# EAGLE schematic calculator6 (EAGLE 9.6.2)

## Sheet 1 of 2
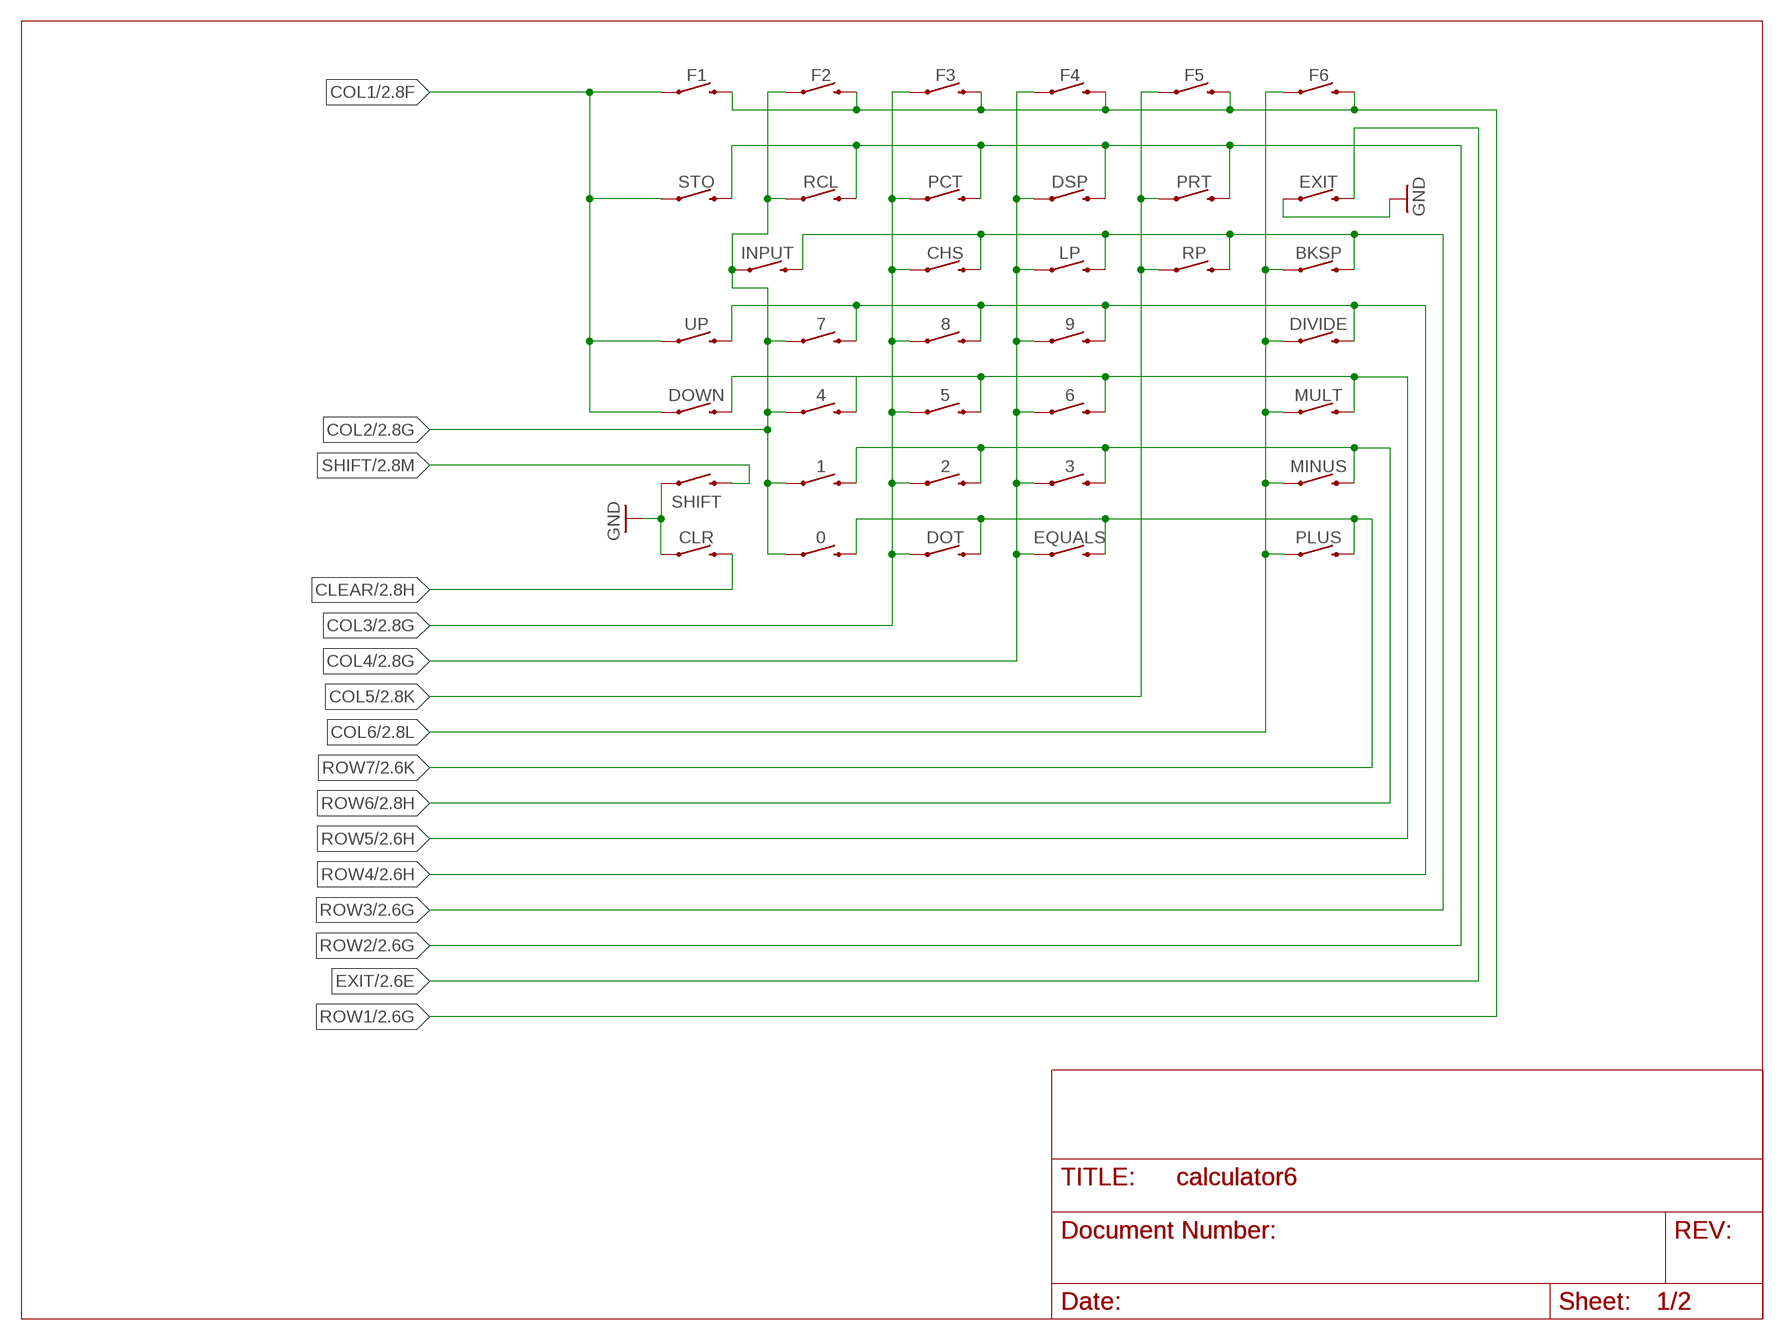
[diagram p0: schematic, sheet 1]

### Parts
0  BUTTON  [BUTTON]
1  BUTTON  [BUTTON]
2  BUTTON  [BUTTON]
3  BUTTON  [BUTTON]
4  BUTTON  [BUTTON]
5  BUTTON  [BUTTON]
6  BUTTON  [BUTTON]
7  BUTTON  [BUTTON]
8  BUTTON  [BUTTON]
9  BUTTON  [BUTTON]
BKSP  BUTTON  [BUTTON]
CHS  BUTTON  [BUTTON]
CLR  BUTTON  [BUTTON]
DIVIDE  BUTTON  [BUTTON]
DOT  BUTTON  [BUTTON]
DOWN  BUTTON  [BUTTON]
DSP  BUTTON  [BUTTON]
EQUALS  BUTTON  [BUTTON]
EXIT  BUTTON  [BUTTON]
F1  BUTTON  [BUTTON]
F2  BUTTON  [BUTTON]
F3  BUTTON  [BUTTON]
F4  BUTTON  [BUTTON]
F5  BUTTON  [BUTTON]
F6  BUTTON  [BUTTON]
INPUT  BUTTON  [BUTTON]
LP  BUTTON  [BUTTON]
MINUS  BUTTON  [BUTTON]
MULT  BUTTON  [BUTTON]
PCT  BUTTON  [BUTTON]
PLUS  BUTTON  [BUTTON]
PRT  BUTTON  [BUTTON]
RCL  BUTTON  [BUTTON]
RP  BUTTON  [BUTTON]
SHIFT  BUTTON  [BUTTON]
STO  BUTTON  [BUTTON]
UP  BUTTON  [BUTTON]

### Nets
CLEAR: CLR.3 ; also sheet 2
COL1: DOWN.1 F1.1 STO.1 UP.1 ; also sheet 2
COL2: 0.1 1.1 4.1 7.1 F2.1 INPUT.1 RCL.1 ; also sheet 2
COL3: 2.1 5.1 8.1 CHS.1 DOT.1 F3.1 PCT.1 ; also sheet 2
COL4: 3.1 6.1 9.1 DSP.1 EQUALS.1 F4.1 LP.1 ; also sheet 2
COL5: F5.1 PRT.1 RP.1 ; also sheet 2
COL6: BKSP.1 DIVIDE.1 F6.1 MINUS.1 MULT.1 PLUS.1 ; also sheet 2
EXIT: EXIT.3 ; also sheet 2
GND: CLR.1 EXIT.1 SHIFT.1 ; also sheet 2
ROW1: F1.3 F2.3 F3.3 F4.3 F5.3 F6.3 ; also sheet 2
ROW2: DSP.3 PCT.3 PRT.3 RCL.3 STO.3 ; also sheet 2
ROW3: BKSP.3 CHS.3 INPUT.3 LP.3 RP.3 ; also sheet 2
ROW4: 7.3 8.3 9.3 DIVIDE.3 UP.3 ; also sheet 2
ROW5: 4.3 5.3 6.3 DOWN.3 MULT.3 ; also sheet 2
ROW6: 1.3 2.3 3.3 MINUS.3 ; also sheet 2
ROW7: 0.3 DOT.3 EQUALS.3 PLUS.3 ; also sheet 2
SHIFT: SHIFT.3 ; also sheet 2

## Sheet 2 of 2
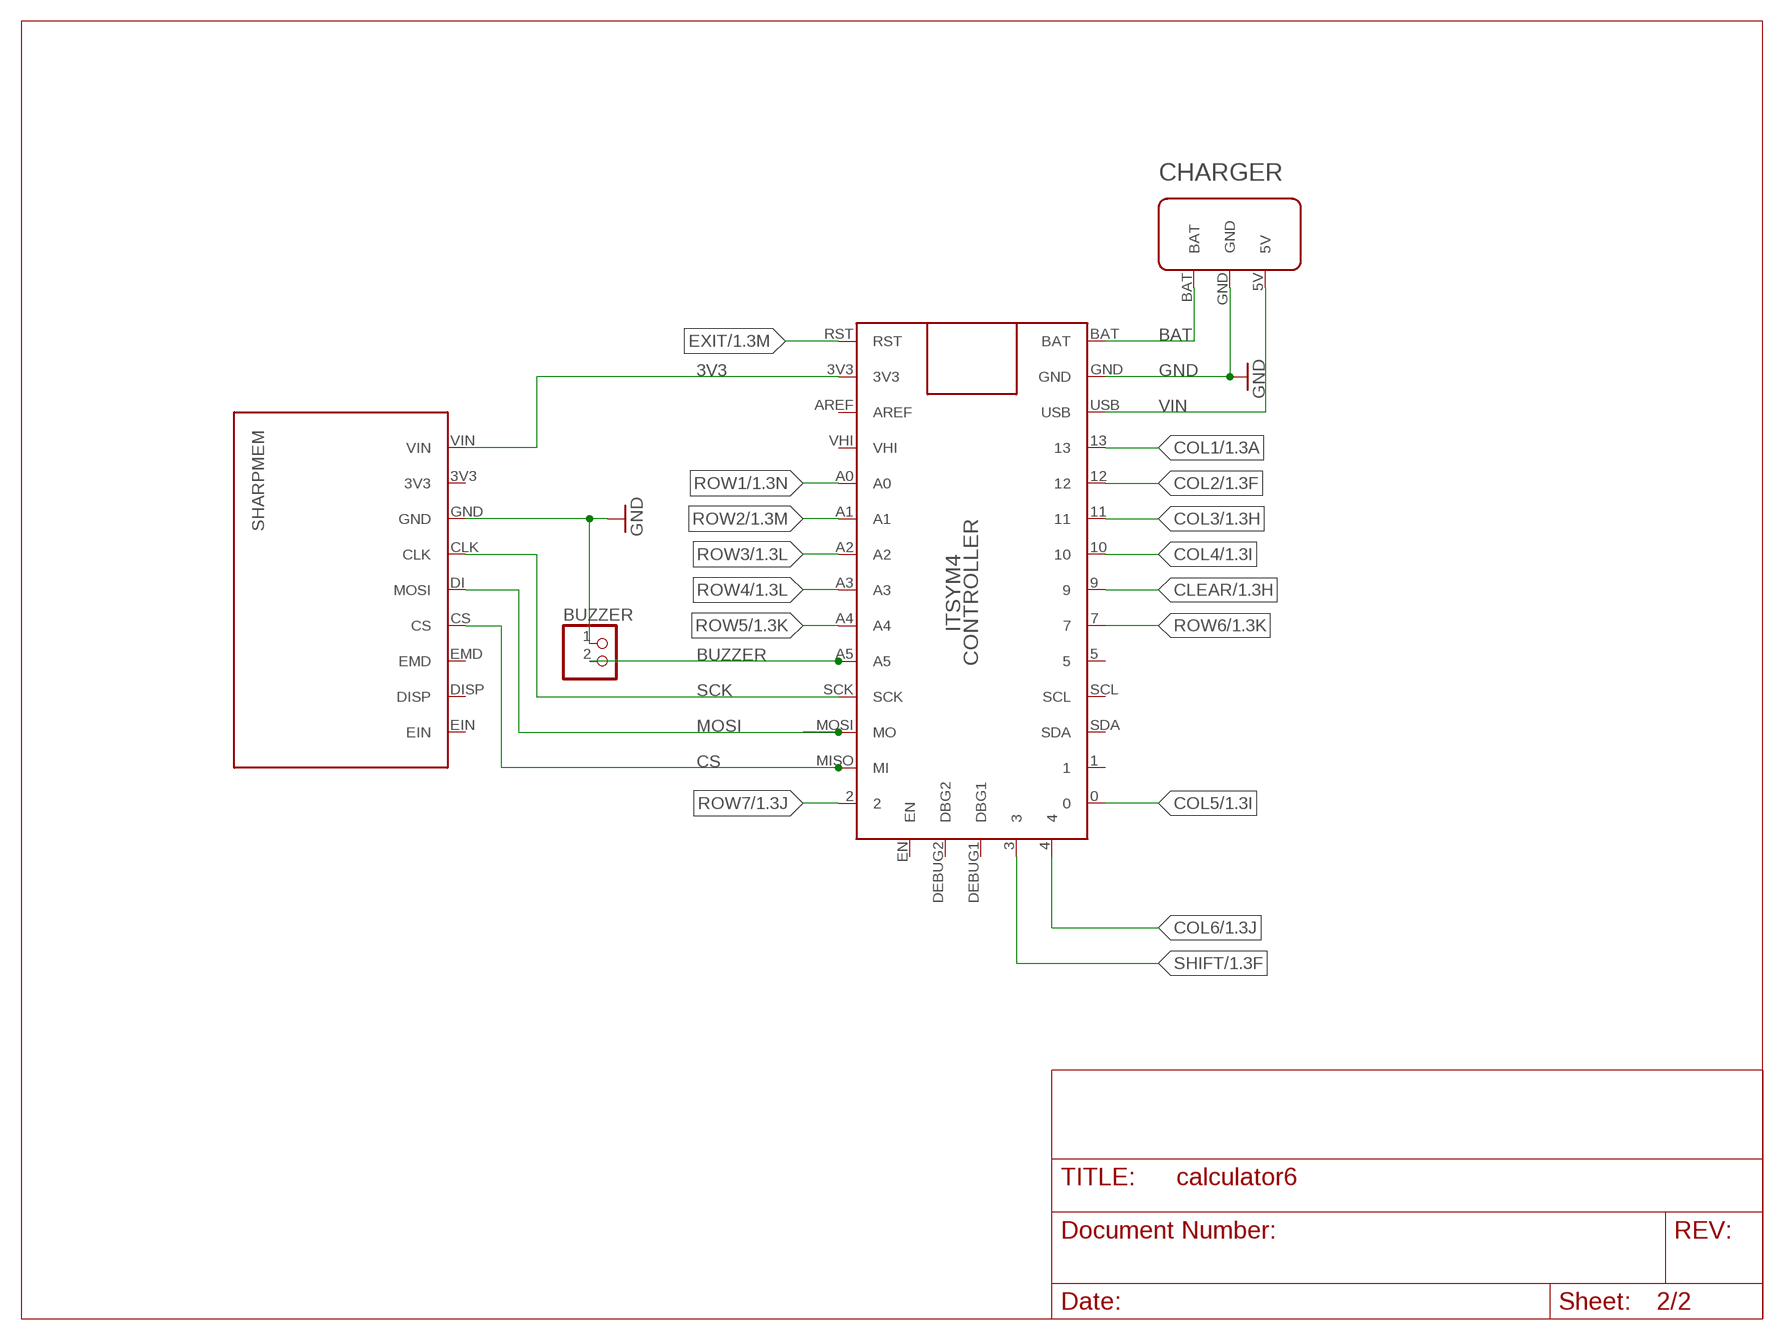
[diagram p1: schematic, sheet 2]

### Parts
BUZZER  PINHD-1X2  [1X02]
CHARGER  LIPO_BACKPACK  [LIPO_BACKPACK]
CONTROLLER  ITSYM4  [ITSYM4]
SHARPMEM  SHARPMEM  [SHARPMEM]

### Nets
3V3: CONTROLLER.3V3 SHARPMEM.VIN
BAT: CHARGER.BAT CONTROLLER.BAT
BUZZER: BUZZER.2 CONTROLLER.A5
CLEAR: CONTROLLER.9 ; also sheet 1
COL1: CONTROLLER.13 ; also sheet 1
COL2: CONTROLLER.12 ; also sheet 1
COL3: CONTROLLER.11 ; also sheet 1
COL4: CONTROLLER.10 ; also sheet 1
COL5: CONTROLLER.0 ; also sheet 1
COL6: CONTROLLER.4 ; also sheet 1
CS: CONTROLLER.MISO(MI) SHARPMEM.CS
EXIT: CONTROLLER.RST ; also sheet 1
GND: BUZZER.1 CHARGER.GND CONTROLLER.GND SHARPMEM.GND ; also sheet 1
MOSI: CONTROLLER.MOSI(MO) SHARPMEM.DI(MOSI)
ROW1: CONTROLLER.A0 ; also sheet 1
ROW2: CONTROLLER.A1 ; also sheet 1
ROW3: CONTROLLER.A2 ; also sheet 1
ROW4: CONTROLLER.A3 ; also sheet 1
ROW5: CONTROLLER.A4 ; also sheet 1
ROW6: CONTROLLER.7 ; also sheet 1
ROW7: CONTROLLER.2 ; also sheet 1
SCK: CONTROLLER.SCK SHARPMEM.CLK
SHIFT: CONTROLLER.3 ; also sheet 1
VIN: CHARGER.5V CONTROLLER.USB
Unconnected: CONTROLLER.1 CONTROLLER.5 CONTROLLER.AREF CONTROLLER.DEBUG1(DBG1) CONTROLLER.DEBUG2(DBG2) CONTROLLER.EN CONTROLLER.SCL CONTROLLER.SDA CONTROLLER.VHI SHARPMEM.3V3 SHARPMEM.DISP SHARPMEM.EIN SHARPMEM.EMD

## Library data of the parts
0 1-9 BKSP CHS CLR DIVIDE DOT DOWN DSP EQUALS EXIT F1-F6 INPUT LP MINUS MULT PCT PLUS PRT RCL RP SHIFT STO UP = aaa_pw:BUTTON
BUZZER = pinhead:PINHD-1X2: PIN HEADER
CHARGER = aaa_pw:LIPO_BACKPACK
CONTROLLER = aaa_pw:ITSYM4
SHARPMEM = aaa_pw:SHARPMEM